# Altium schematic sheet MCU.SchDoc
size 420 x 297 mm; SheetNumber: 4; SheetTotal: 8
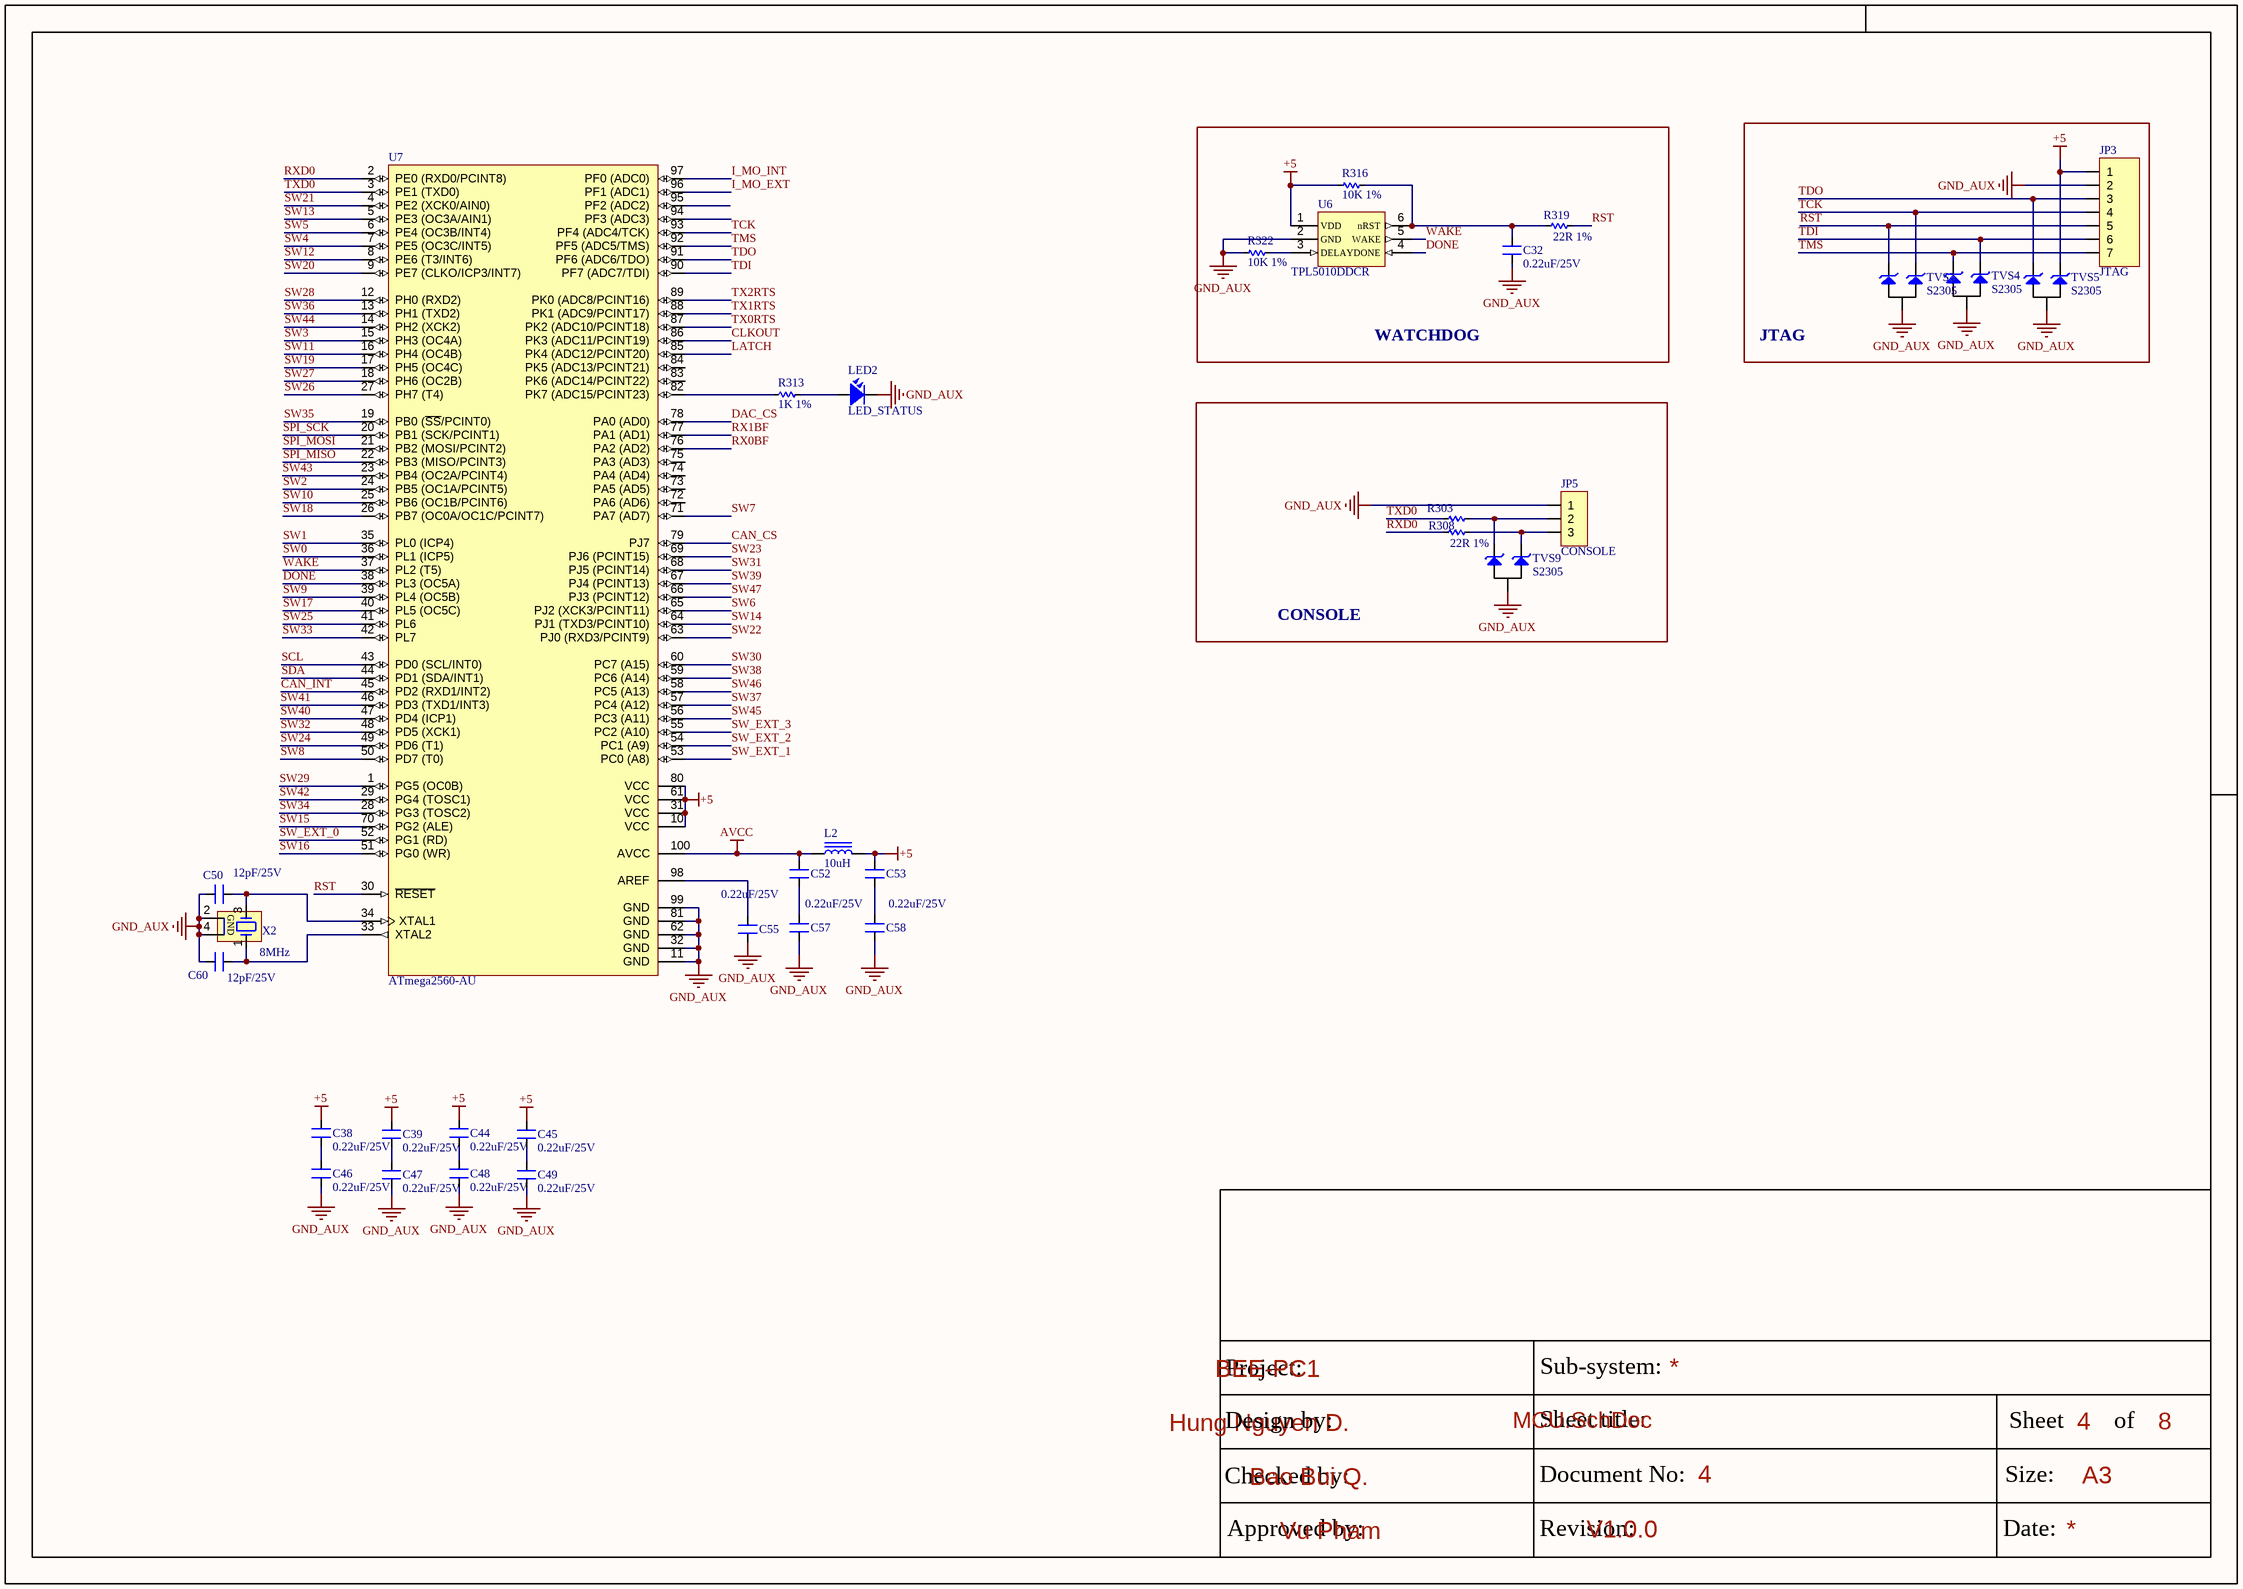
[diagram p0: MCU.SchDoc]

## Parts
C32  0.22uF/25V  [SM-0603]
C38  0.22uF/25V  [SM-0603]
C39  0.22uF/25V  [SM-0603]
C44  0.22uF/25V  [SM-0603]
C45  0.22uF/25V  [SM-0603]
C46  0.22uF/25V  [SM-0603]
C47  0.22uF/25V  [SM-0603]
C48  0.22uF/25V  [SM-0603]
C49  0.22uF/25V  [SM-0603]
C50  12pF/25V  [SM-0603]
C52  0.22uF/25V  [SM-0603]  (value not drawn)
C53  0.22uF/25V  [SM-0603]  (value not drawn)
C55  0.22uF/25V  [SM-0603]
C57  0.22uF/25V  [SM-0603]
C58  0.22uF/25V  [SM-0603]
C60  12pF/25V  [SM-0603]
JP3  JTAG  [0532610771]
JP5  CONSOLE  [0532610371]
L2  10uH  [FER 0805/2012]
LED2  LED_STATUS  [GREENLED_0603]
R303  22R 1%  [RES-SMD-0603]  (value not drawn)
R308  22R 1%  [RES-SMD-0603]
R313  1K 1%  [RES-SMD-0603]
R316  10K 1%  [RES-SMD-0603]
R319  22R 1%  [RES-SMD-0603]
R322  10K 1%  [RES-SMD-0603]
TVS3  S2305  [SOT23-123]
TVS4  S2305  [SOT23-123]
TVS5  S2305  [SOT23-123]
TVS9  S2305  [SOT23-123]
U6  TPL5010DDCR  [SOT23-6]
U7  ATmega2560-AU  [TQFP100L]
X2  8MHz  [XT4-16.000MHz-4_V]

## Blocks framed on the sheet
WATCHDOG: C32 R316 R319 R322 U6
JTAG: JP3 TVS3-TVS5
CONSOLE: JP5 R303 R308 TVS9

## Nets
+5: C38.1 C39.1 C44.1 C45.1 C53.2 JP3.1 L2.2 R316.1 TVS5.3 U6.1(VDD) U7.10(VCC) U7.31(VCC) U7.61(VCC) U7.80(VCC)
AVCC: C52.2 L2.1 U7.100(AVCC)
GND_AUX: C32.2 C46.2 C47.2 C48.2 C49.2 C50.2 C55.1 C57.1 C58.1 C60.2 JP3.2 JP5.1 LED2.2 R322.1 TVS3.2 TVS4.2 TVS5.2 TVS9.2 U6.2(GND) U7.11(GND) U7.32(GND) U7.62(GND) U7.81(GND) U7.99(GND) X2.2(GND) X2.4(GND)
CAN_CS: U7.79(PJ7)
CAN_INT: U7.45(PD2_(RXD1/INT2))
CLKOUT: U7.86(PK3_(ADC11/PCINT19))
DAC_CS: U7.78(PA0_(AD0))
DONE: U6.4(DONE) U7.38(PL3_(OC5A))
I_MO_EXT: U7.96(PF1_(ADC1))
I_MO_INT: U7.97(PF0_(ADC0))
LATCH: U7.85(PK4_(ADC12/PCINT20))
RST: JP3.5 R319.2 TVS3.1 U7.30(~{RESET})
RX0BF: U7.76(PA2_(AD2))
RX1BF: U7.77(PA1_(AD1))
RXD0: R308.1 U7.2(PE0_(RXD0/PCINT8))
SCL: U7.43(PD0_(SCL/INT0))
SDA: U7.44(PD1_(SDA/INT1))
SPI_MISO: U7.22(PB3_(MISO/PCINT3))
SPI_MOSI: U7.21(PB2_(MOSI/PCINT2))
SPI_SCK: U7.20(PB1_(SCK/PCINT1))
SW0: U7.36(PL1_(ICP5))
SW1: U7.35(PL0_(ICP4))
SW2: U7.24(PB5_(OC1A/PCINT5))
SW3: U7.15(PH3_(OC4A))
SW4: U7.7(PE5_(OC3C/INT5))
SW5: U7.6(PE4_(OC3B/INT4))
SW6: U7.65(PJ2_(XCK3/PCINT11))
SW7: U7.71(PA7_(AD7))
SW8: U7.50(PD7_(T0))
SW9: U7.39(PL4_(OC5B))
SW10: U7.25(PB6_(OC1B/PCINT6))
SW11: U7.16(PH4_(OC4B))
SW12: U7.8(PE6_(T3/INT6))
SW13: U7.5(PE3_(OC3A/AIN1))
SW14: U7.64(PJ1_(TXD3/PCINT10))
SW15: U7.70(PG2_(ALE))
SW16: U7.51(PG0_(WR))
SW17: U7.40(PL5_(OC5C))
SW18: U7.26(PB7_(OC0A/OC1C/PCINT7))
SW19: U7.17(PH5_(OC4C))
SW20: U7.9(PE7_(CLKO/ICP3/INT7))
SW21: U7.4(PE2_(XCK0/AIN0))
SW22: U7.63(PJ0_(RXD3/PCINT9))
SW23: U7.69(PJ6_(PCINT15))
SW24: U7.49(PD6_(T1))
SW25: U7.41(PL6)
SW26: U7.27(PH7_(T4))
SW27: U7.18(PH6_(OC2B))
SW28: U7.12(PH0_(RXD2))
SW29: U7.1(PG5_(OC0B))
SW30: U7.60(PC7_(A15))
SW31: U7.68(PJ5_(PCINT14))
SW32: U7.48(PD5_(XCK1))
SW33: U7.42(PL7)
SW34: U7.28(PG3_(TOSC2))
SW35: U7.19(PB0_(~{SS}/PCINT0))
SW36: U7.13(PH1_(TXD2))
SW37: U7.57(PC4_(A12))
SW38: U7.59(PC6_(A14))
SW39: U7.67(PJ4_(PCINT13))
SW40: U7.47(PD4_(ICP1))
SW41: U7.46(PD3_(TXD1/INT3))
SW42: U7.29(PG4_(TOSC1))
SW43: U7.23(PB4_(OC2A/PCINT4))
SW44: U7.14(PH2_(XCK2))
SW45: U7.56(PC3_(A11))
SW46: U7.58(PC5_(A13))
SW47: U7.66(PJ3_(PCINT12))
SW_EXT_0: U7.52(PG1_(RD))
SW_EXT_1: U7.53(PC0_(A8))
SW_EXT_2: U7.54(PC1_(A9))
SW_EXT_3: U7.55(PC2_(A10))
TCK: JP3.4 TVS3.3 U7.93(PF4_(ADC4/TCK))
TDI: JP3.6 TVS4.3 U7.90(PF7_(ADC7/TDI))
TDO: JP3.3 TVS5.1 U7.91(PF6_(ADC6/TDO))
TMS: JP3.7 TVS4.1 U7.92(PF5_(ADC5/TMS))
TX0RTS: U7.87(PK2_(ADC10/PCINT18))
TX1RTS: U7.88(PK1_(ADC9/PCINT17))
TX2RTS: U7.89(PK0_(ADC8/PCINT16))
TXD0: R303.1 U7.3(PE1_(TXD0))
WAKE: U6.5(WAKE) U7.37(PL2_(T5))
NetC32_1: C32.1 R316.2 R319.1 U6.6(nRST)
NetC38_2: C38.2 C46.1
NetC39_2: C39.2 C47.1
NetC44_2: C44.2 C48.1
NetC45_2: C45.2 C49.1
NetC50_1: C50.1 U7.34(XTAL1) X2.3(XTAL)
NetC52_1: C52.1 C57.2
NetC53_1: C53.1 C58.2
NetC55_2: C55.2 U7.98(AREF)
NetC60_1: C60.1 U7.33(XTAL2) X2.1(XTAL)
NetJP5_2: JP5.2 R303.2 TVS9.1
NetJP5_3: JP5.3 R308.2 TVS9.3
NetLED2_1: LED2.1 R313.1
NetR313_2: R313.2 U7.82(PK7_(ADC15/PCINT23))
NetR322_2: R322.2 U6.3(DELAY)

Not connected (* = marked no-connect by the designer): U7 72(PA6_(AD6)) 73(PA5_(AD5)) 74(PA4_(AD4)) 75(PA3_(AD3)) 83(PK6_(ADC14/PCINT22)) 84(PK5_(ADC13/PCINT21)) 94(PF3_(ADC3)) 95(PF2_(ADC2))

## Notes on the sheet
- Project:
- BEE-PC1
- Sub-system:
- Design by:
- Hung Nguyen D.
- Bao Bui Q.
- Sheet title:
- Sheet
- A3
- of
- Checked by:
- Approved by:
- Vu Pham
- Revision:
- Document No:
- V1.0.0
- Size:
- Date:

## Library data of the parts
C32 C38 C39 C44-C50 C52 C53 C55 C57 C58 C60 = CM: 0603; Value: 103
JP3 = JP7: WR-PHD 2.54 mm Angled Socket Header; Manufacturer: W¨¹rth Elektronik eiSos GmbH; partNo: 613007143121; ComponentLink1 Description: Manufacturer; ComponentLink2 Description: Datasheet; NoPins: 07; Created Date: 29 March 2013; ComponentLink1URL: http://www.we-online.com; ComponentLink2URL: http://katalog.we-online.de/em/datasheet/6130xx143121.pdf; Created by: Karrer Zheng
JP5 = JP3: WR-PHD 2.54 mm Angled Socket Header; Manufacturer: W¨¹rth Elektronik eiSos GmbH; partNo: 613003143121; ComponentLink1 Description: Manufacturer; ComponentLink2 Description: Datasheet; NoPins: 03; Created Date: 29 March 2013; ComponentLink1URL: http://www.we-online.com; ComponentLink2URL: http://katalog.we-online.de/em/datasheet/6130xx143121.pdf; Created by: Karrer Zheng
L2 = Inductor: MLZ1608N100LT000; Value: 1.5uH
LED2 = LED SMD: Value: LED 3 - 5 ly 2 Colour
R303 R308 R313 R316 R319 R322 = Res-SMD: 0603; Manufacturer: Generic Components; Class: Passive; Published: 08/06/2000; Publisher: Altium Hobart Technology Centre
TVS3-TVS5 TVS9 = S2303: TVS DIODE 5VWM 10.8VC SOT23, P/N: / S2305
U6 = TPL5010DDCR: TSOT23-6
U7 = ATmega2560-AU: 8-bit AVR Microcontroller, 4.5-5.5V, 256KB Flash, 4KB EEPROM, 8KB SRAM, 86 GPIO pins, 100-pin TQFP, Industrial Grade (-40°C to 85°C), Pb-Free; Supplier 1: Digi-Key; Supplier Part Number 1: ATMEGA2560-16AUR-ND
X2 = XT4: ECS-80-8-33Q-ADS; Value: 4Mhz